# EAGLE design DAUGHTER_AUDIO (EAGLE 7.6.0)
DAUGHTER CARD AUDIO

## Sheet 1 of 3: HDK INTERFACE
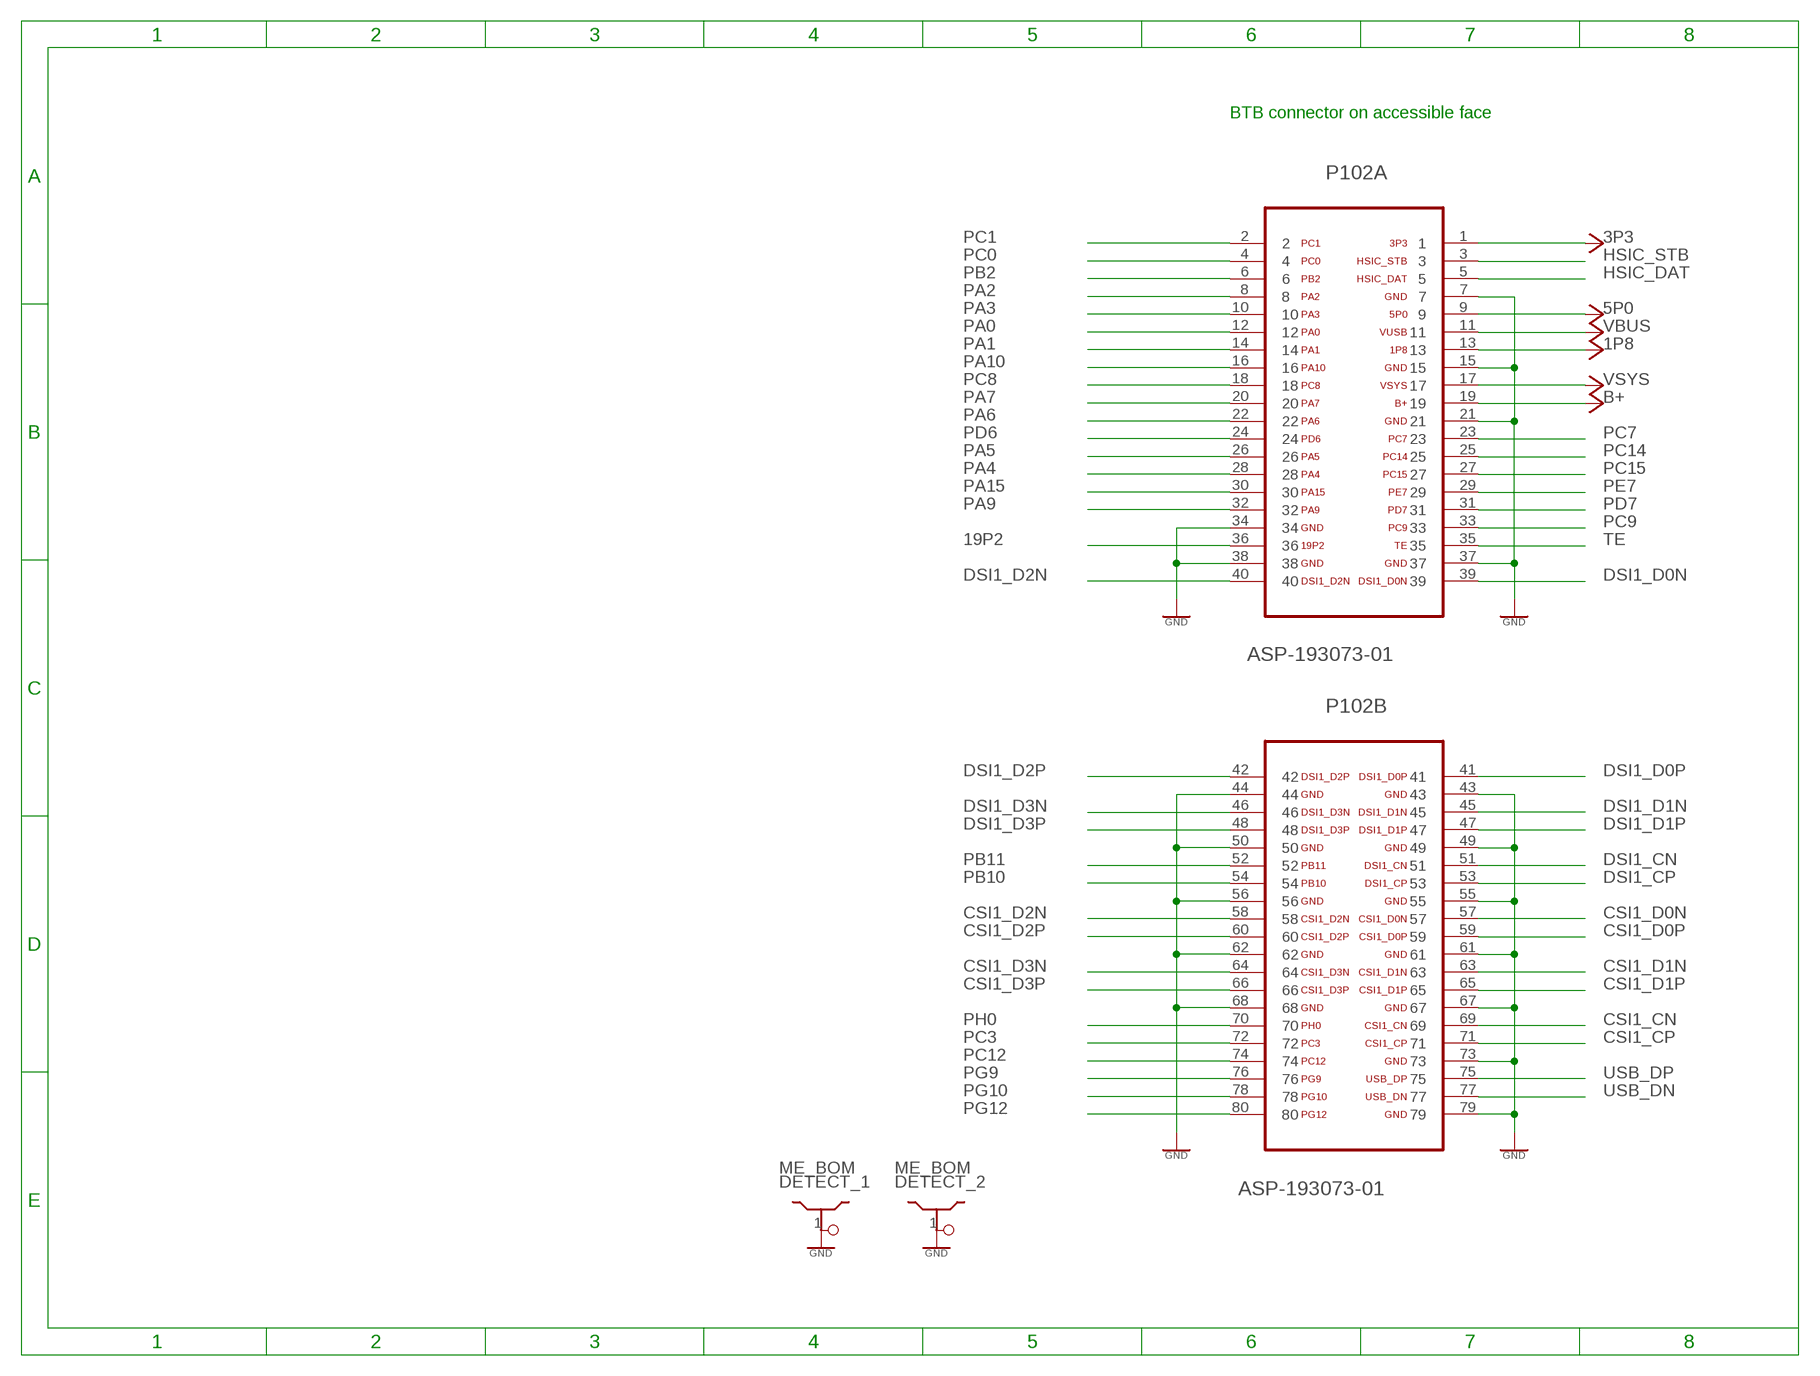
[diagram p0: schematic, sheet 1]

### Parts
DETECT_1  ME_BOM  SHIELDDETECT  [PLUG]
DETECT_2  ME_BOM  SHIELDDETECT  [PLUG]
P102  ASP-193073-01  FTMH-140-02-L-DV-ES-P-TR  [FTMH-140-02-L-DV-ES-P-TR]

### Nets
1P8: P102.13 ; also sheet 2,3
3P3: P102.1 ; also sheet 2
5P0: P102.9
19P2: P102.36
B+: P102.19 ; also sheet 3
CSI1_CN: P102.69
CSI1_CP: P102.71
CSI1_D0N: P102.57
CSI1_D0P: P102.59
CSI1_D1N: P102.63
CSI1_D1P: P102.65
CSI1_D2N: P102.58
CSI1_D2P: P102.60
CSI1_D3N: P102.64
CSI1_D3P: P102.66
DSI1_CN: P102.51
DSI1_CP: P102.53
DSI1_D0N: P102.39
DSI1_D0P: P102.41
DSI1_D1N: P102.45
DSI1_D1P: P102.47
DSI1_D2N: P102.40
DSI1_D2P: P102.42
DSI1_D3N: P102.46
DSI1_D3P: P102.48
GND: DETECT_1.1 DETECT_2.1 P102.7 P102.15 P102.21 P102.34 P102.37 P102.38 P102.43 P102.44 P102.49 P102.50 P102.55 P102.56 P102.61 P102.62 P102.67 P102.68 P102.73 P102.79 ; also sheet 2,3
HSIC_DAT: P102.5
HSIC_STB: P102.3
PA0: P102.12
PA1: P102.14
PA2: P102.8
PA3: P102.10
PA4: P102.28
PA5: P102.26
PA6: P102.22
PA7: P102.20
PA9: P102.32
PA10: P102.16
PA15: P102.30
PB2: P102.6
PB10: P102.54 ; also sheet 2
PB11: P102.52 ; also sheet 2
PC0: P102.4 ; also sheet 3
PC1: P102.2 ; also sheet 3
PC3: P102.72
PC7: P102.23 ; also sheet 3
PC8: P102.18
PC9: P102.33
PC12: P102.74
PC14: P102.25 ; also sheet 3
PC15: P102.27 ; also sheet 3
PD6: P102.24
PD7: P102.31 ; also sheet 3
PE7: P102.29 ; also sheet 3
PG9: P102.76 ; also sheet 2
PG10: P102.78 ; also sheet 3
PG12: P102.80
PH0: P102.70 ; also sheet 3
TE: P102.35
USB_DN: P102.77
USB_DP: P102.75
VBUS: P102.11
VSYS: P102.17

### Notes on the sheet
- BTB connector on accessible face

## Sheet 2 of 3: Identification
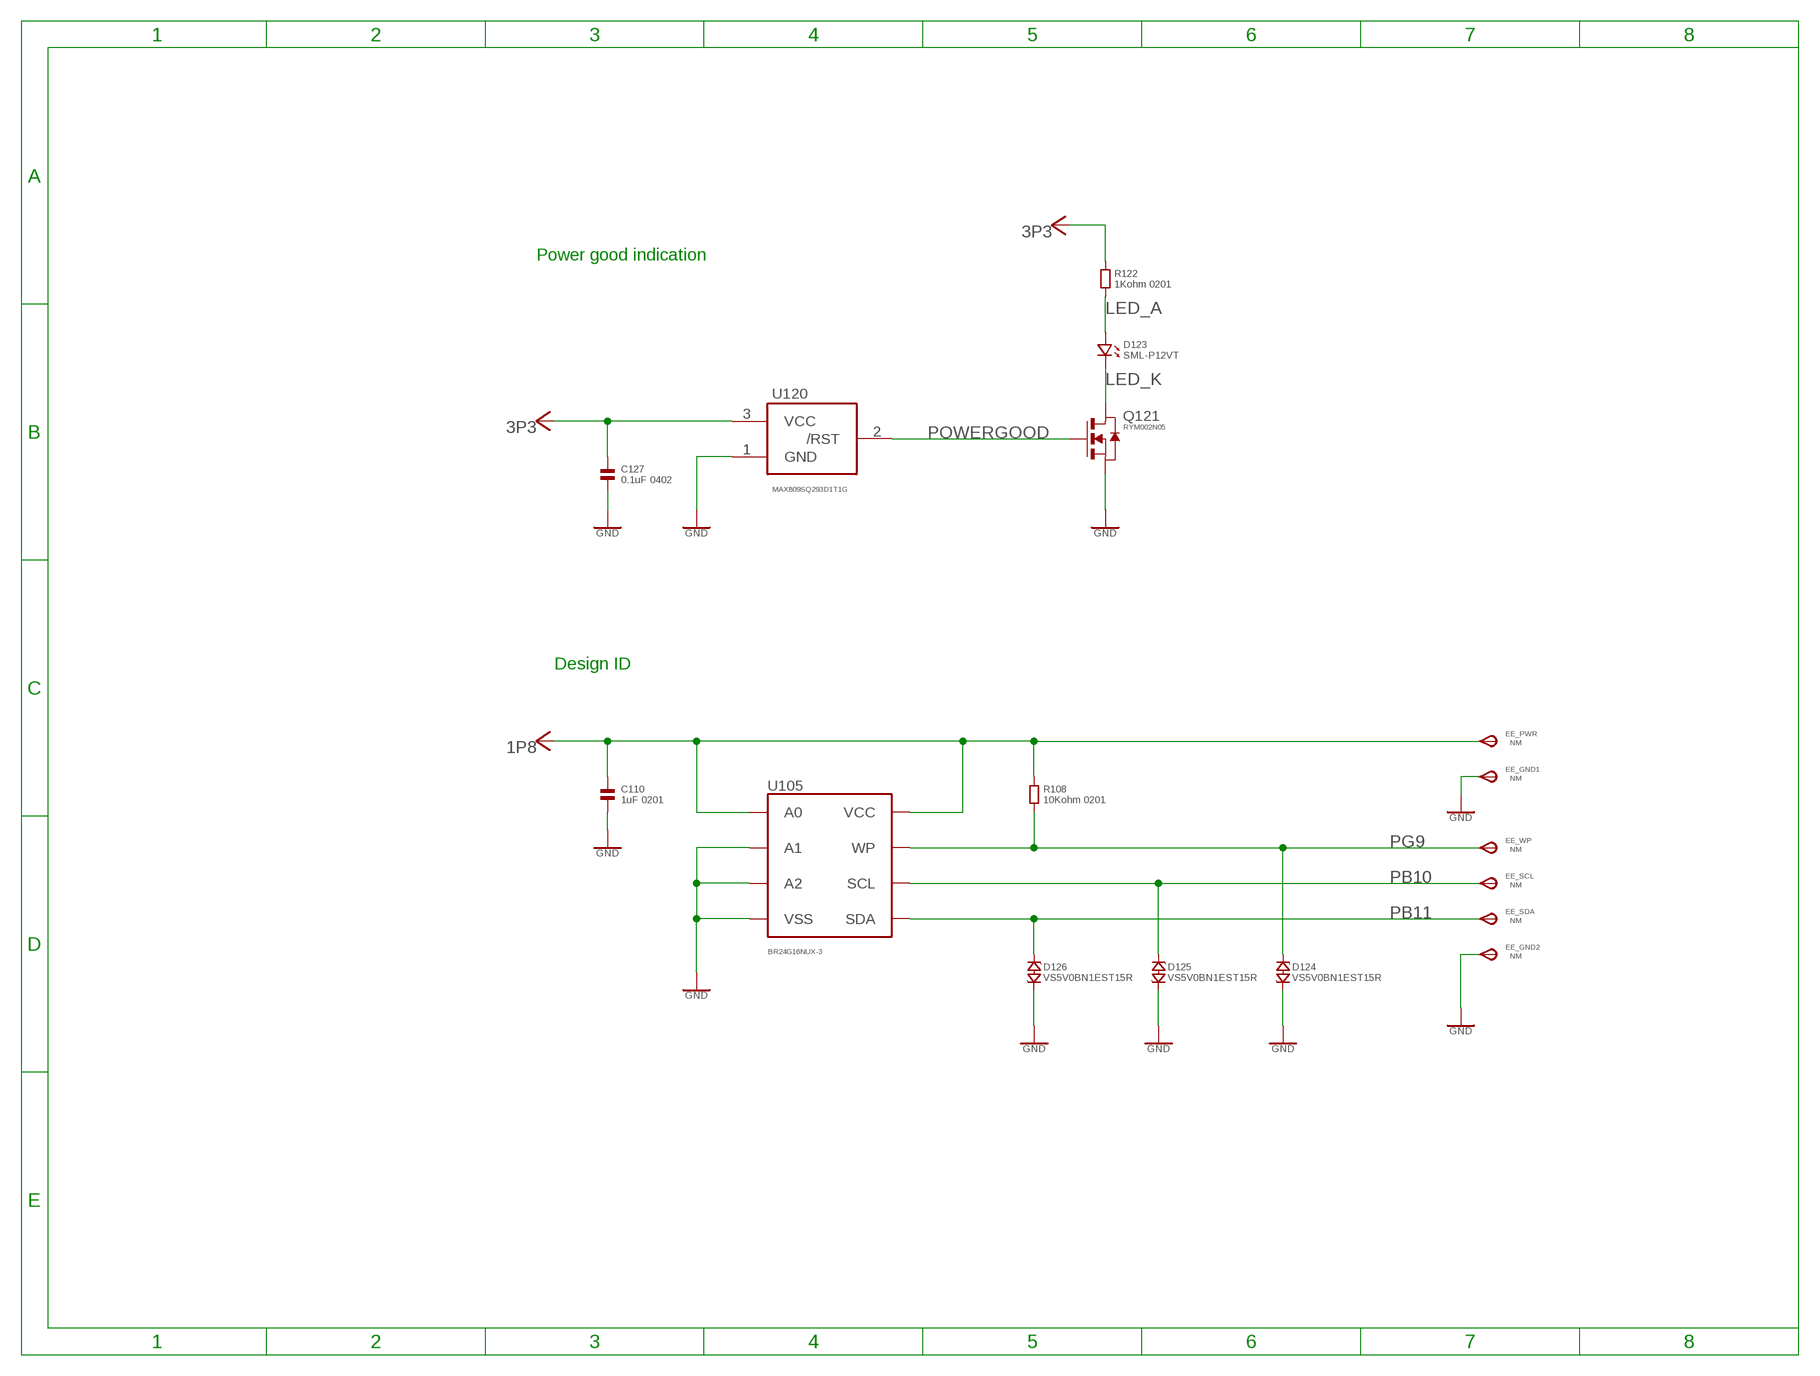
[diagram p1: schematic, sheet 2]

### Parts
C110  1uF 0201  CAPACITOR.0201  [0201]
C127  0.1uF 0402  CAPACITOR.0402  [0402]
D123  SML-P12VT  LED.0503  [0503.LED]
D124  VS5V0BN1EST15R  ESD_VARISTOR.0201  [CHIP_0201]
D125  VS5V0BN1EST15R  ESD_VARISTOR.0201  [CHIP_0201]
D126  VS5V0BN1EST15R  ESD_VARISTOR.0201  [CHIP_0201]
EE_GND1  NM  TPSTP11R  [TP11R]
EE_GND2  NM  TPSTP11R  [TP11R]
EE_PWR  NM  TPSTP11R  [TP11R]
EE_SCL  NM  TPSTP11R  [TP11R]
EE_SDA  NM  TPSTP11R  [TP11R]
EE_WP  NM  TPSTP11R  [TP11R]
Q121  RYM002N05  FET-NRYM002N05  [VMT3]
R108  10Kohm 0201  RESISTOR.0201  [0201]
R122  1Kohm 0201  RESISTOR.0201  [0201]
U105  BR24G16NUX-3  EEPROMDFN8  [DFN-8]
U120  MAX809SQ293D1T1G  MAX809  [SC70-3L]

### Nets
1P8: C110.1 EE_PWR.TP(PP) R108.1 U105.P$1(A0) U105.P$8(VCC) ; also sheet 1,3
3P3: C127.1 R122.1 U120.3(VCC) ; also sheet 1
GND: C110.2 C127.2 D124.P$2 D125.P$2 D126.P$2 EE_GND1.TP(PP) EE_GND2.TP(PP) Q121.2(S) U105.P$2(A1) U105.P$3(A2) U105.P$4(VSS) U105.P$9(VSS) U120.1(GND) ; also sheet 1,3
LED_A: D123.P$1 R122.2
LED_K: D123.P$2 Q121.3(D)
PB10: D125.P$1 EE_SCL.TP(PP) U105.P$6(SCL) ; also sheet 1
PB11: D126.P$1 EE_SDA.TP(PP) U105.P$5(SDA) ; also sheet 1
PG9: D124.P$1 EE_WP.TP(PP) R108.2 U105.P$7(WP) ; also sheet 1
POWERGOOD: Q121.1(G) U120.2(/RST)

### Notes on the sheet
- Power good indication
- Design ID

## Sheet 3 of 3: LOUD SPEAKER
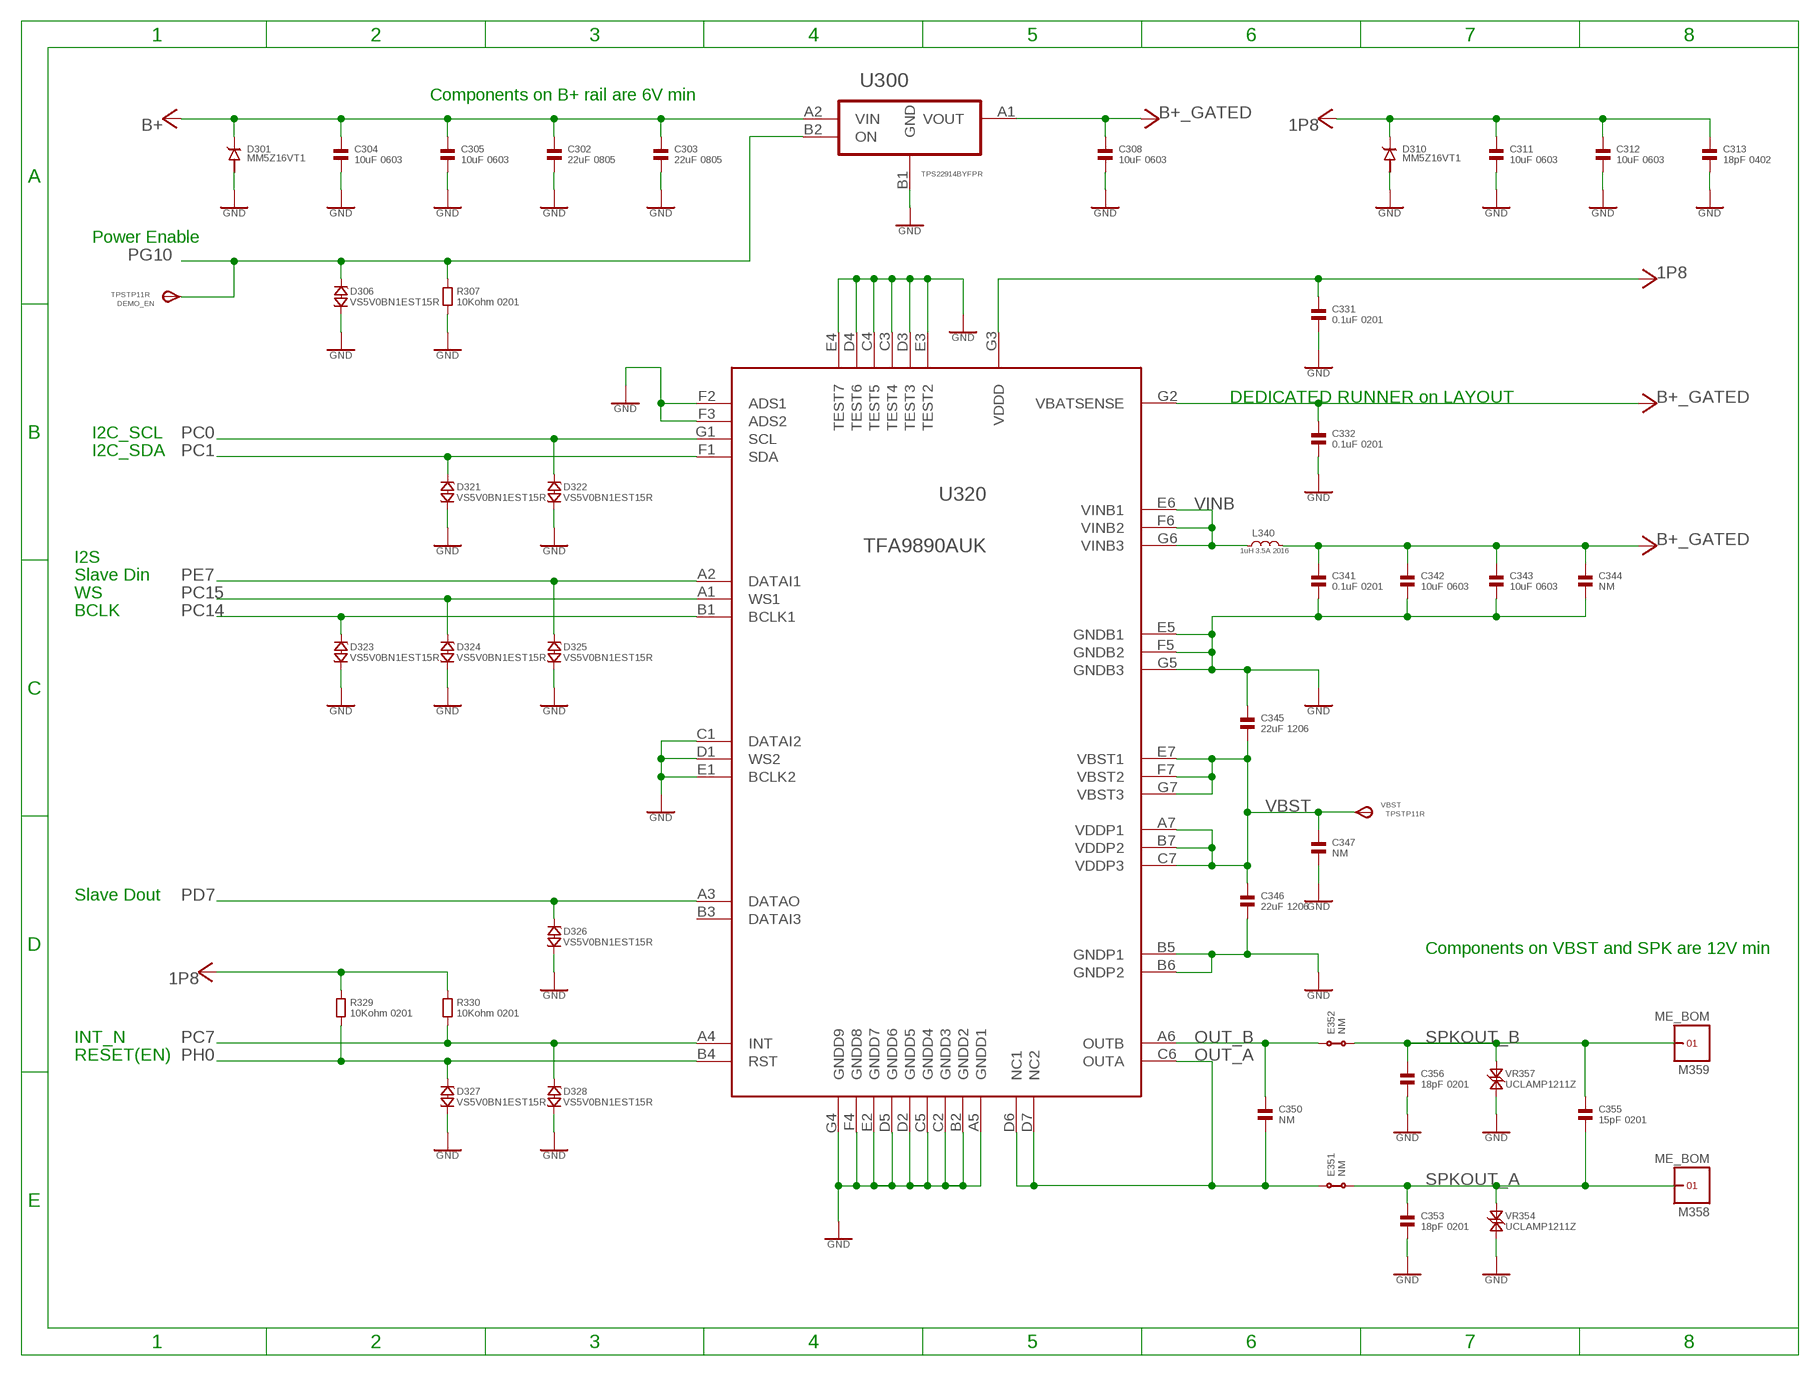
[diagram p2: schematic, sheet 3]

### Parts
C302  22uF 0805  CAPACITOR.0805  [0805]
C303  22uF 0805  CAPACITOR.0805  [0805]
C304  10uF 0603  CAPACITOR.0603  [0603]
C305  10uF 0603  CAPACITOR.0603  [0603]
C308  10uF 0603  CAPACITOR.0603  [0603]
C311  10uF 0603  CAPACITOR.0603  [0603]
C312  10uF 0603  CAPACITOR.0603  [0603]
C313  18pF 0402  CAPACITOR.0402  [0402]
C331  0.1uF 0201  CAPACITOR.0201  [0201]
C332  0.1uF 0201  CAPACITOR.0201  [0201]
C341  0.1uF 0201  CAPACITOR.0201  [0201]
C342  10uF 0603  CAPACITOR.0603  [0603]
C343  10uF 0603  CAPACITOR.0603  [0603]
C344  NM  CAPACITOR.0402  [0402]
C345  22uF 1206  CAPACITOR.1206  [1206]
C346  22uF 1206  CAPACITOR.1206  [1206]
C347  NM  CAPACITOR.0402  [0402]
C350  NM  CAPACITOR.0201  [0201]
C353  18pF 0201  CAPACITOR.0201  [0201]
C355  15pF 0201  CAPACITOR.0201  [0201]
C356  18pF 0201  CAPACITOR.0201  [0201]
D301  MM5Z16VT1  DIODE.SOD523  [SOD523]
D306  VS5V0BN1EST15R  ESD_VARISTOR.0201  [CHIP_0201]
D310  MM5Z16VT1  DIODE.SOD523  [SOD523]
D321  VS5V0BN1EST15R  ESD_VARISTOR.0201  [CHIP_0201]
D322  VS5V0BN1EST15R  ESD_VARISTOR.0201  [CHIP_0201]
D323  VS5V0BN1EST15R  ESD_VARISTOR.0201  [CHIP_0201]
D324  VS5V0BN1EST15R  ESD_VARISTOR.0201  [CHIP_0201]
D325  VS5V0BN1EST15R  ESD_VARISTOR.0201  [CHIP_0201]
D326  VS5V0BN1EST15R  ESD_VARISTOR.0201  [CHIP_0201]
D327  VS5V0BN1EST15R  ESD_VARISTOR.0201  [CHIP_0201]
D328  VS5V0BN1EST15R  ESD_VARISTOR.0201  [CHIP_0201]
DEMO_EN  TPSTP11R  [TP11R]
E351  NM  SHORT_BAR.0603  [0603_SHORT]
E352  NM  SHORT_BAR.0603  [0603_SHORT]
L340  1uH 3.5A 2016  POWER-INDUCTOR.2016  [2016]
M358  ME_BOM  PUCK.PUCK  [PUCK]
M359  ME_BOM  PUCK.PUCK  [PUCK]
R307  10Kohm 0201  RESISTOR.0201  [0201]
R329  10Kohm 0201  RESISTOR.0201  [0201]
R330  10Kohm 0201  RESISTOR.0201  [0201]
U300  TPS22914BYFPR  [BGA0_75SQ_PS0_4_P4]
U320  TFA9890AUK  [BGA7X7]
VBST  TPSTP11R  [TP11R]
VR354  UCLAMP1211Z  ESD_TVS.0201  [CHIP_0201]
VR357  UCLAMP1211Z  ESD_TVS.0201  [CHIP_0201]

### Nets
1P8: C311.1 C312.1 C313.1 C331.1 D310.1 R329.1 R330.1 U320.G3(VDDD) ; also sheet 1,2
B+: C302.1 C303.1 C304.1 C305.1 D301.1 U300.A2(VIN) ; also sheet 1
B+_GATED: C308.1 C332.1 C341.1 C342.1 C343.1 C344.1 L340.2 U300.A1(VOUT) U320.G2(VBATSENSE)
GND: C302.2 C303.2 C304.2 C305.2 C308.2 C311.2 C312.2 C313.2 C331.2 C332.2 C341.2 C342.2 C343.2 C344.2 C345.1 C346.2 C347.2 C353.2 C356.2 D301.2 D306.P$2 D310.2 D321.P$2 D322.P$2 D323.P$2 D324.P$2 D325.P$2 D326.P$2 D327.P$2 D328.P$2 R307.2 U300.B1(GND) U320.A5(GNDD1) U320.B2(GNDD2) U320.B5(GNDP1) U320.B6(GNDP2) U320.C1(DATAI2) U320.C2(GNDD3) U320.C3(TEST4) U320.C4(TEST5) U320.C5(GNDD4) U320.D1(WS2) U320.D2(GNDD5) U320.D3(TEST3) U320.D4(TEST6) U320.D5(GNDD6) U320.E1(BCLK2) U320.E2(GNDD7) U320.E3(TEST2) U320.E4(TEST7) U320.E5(GNDB1) U320.F2(ADS1) U320.F3(ADS2) U320.F4(GNDD8) U320.F5(GNDB2) U320.G4(GNDD9) U320.G5(GNDB3) VR354.P$2 VR357.P$2 ; also sheet 1,2
OUT_A: C350.2 E351.1 U320.C6(OUTA) U320.D6(NC1) U320.D7(NC2)
OUT_B: C350.1 E352.1 U320.A6(OUTB)
PC0: D322.P$1 U320.G1(SCL) ; also sheet 1
PC1: D321.P$1 U320.F1(SDA) ; also sheet 1
PC7: D328.P$1 R330.2 U320.A4(INT) ; also sheet 1
PC14: D323.P$1 U320.B1(BCLK1) ; also sheet 1
PC15: D324.P$1 U320.A1(WS1) ; also sheet 1
PD7: D326.P$1 U320.A3(DATAO) ; also sheet 1
PE7: D325.P$1 U320.A2(DATAI1) ; also sheet 1
PG10: D306.P$1 DEMO_EN.TP(PP) R307.1 U300.B2(ON) ; also sheet 1
PH0: D327.P$1 R329.2 U320.B4(RST) ; also sheet 1
SPKOUT_A: C353.1 C355.2 E351.2 M358.1 VR354.P$1
SPKOUT_B: C355.1 C356.1 E352.2 M359.1 VR357.P$1
VBST: C345.2 C346.1 C347.1 U320.A7(VDDP1) U320.B7(VDDP2) U320.C7(VDDP3) U320.E7(VBST1) U320.F7(VBST2) U320.G7(VBST3) VBST.TP(PP)
VINB: L340.1 U320.E6(VINB1) U320.F6(VINB2) U320.G6(VINB3)
Unconnected: U320.B3(DATAI3)

### Notes on the sheet
- Components on B+ rail are 6V min
- Power Enable
- DEDICATED RUNNER on LAYOUT
- I2C_SCL
- I2C_SDA
- I2S
- Slave Din
- WS
- BCLK
- Slave Dout
- Components on VBST and SPK are 12V min
- INT_N
- RESET(EN)

## Library data of the parts
C110 C127 C302-C305 C308 C311-C313 C331 C332 C341-C347 C350 C353 C355 C356 = MOTO_LIB:CAPACITOR: Ceramic Capacitor, Generic
D123 = MOTO_LIB:LED: LED GENERIC, single, 2 pin; MPN: SML-P12VT; SUPPLIER: ROHM
D124-D126 D306 D321-D328 = MOTO_LIB:ESD_VARISTOR: GENERIC varistor,single, 2 pin; MPN: VS5V0BN1EST15R; SUPPLIER: ROHM
D301 D310 = MOTO_LIB:DIODE: DIODE GENERIC, single, 2 pin; MPN: MM5Z16VT1; SUPPLIER: ON_SEMI
DEMO_EN EE_GND1 EE_GND2 EE_PWR EE_SCL EE_SDA EE_WP VBST = MOTO_LIB:TPS: TEST Point, 1mm diameter, gold
DETECT_1 DETECT_2 = MOTO_LIB:SHIELD: Shield, Custom; MPN: refer to ME BOM; SUPPLIER: ref to ME BOM
E351 E352 = MOTO_LIB:SHORT_BAR: SHORT BAR - layout feature
L340 = MOTO_LIB:POWER-INDUCTOR: Inductor, Power
M358 M359 = MOTO_LIB:PUCK: test pad; MPN: refer to ME BOM; SUPPLIER: refer to ME BOM
P102 = MOTO_LIB:FTMH-140-02-L-DV-ES-P-TR: MICRO SOCKET, 1.0MM, SMD, 2X40WAY, MALE; MPN: ASP-193073-01; SUPPLIER: SAMTEC
Q121 = MOTO_LIB:FET-N: Generic NMOS FET; MPN: RYM002N05; SUPPLIER: ROHM
R108 R122 R307 R329 R330 = MOTO_LIB:RESISTOR: Resistor - Generic
U105 = MOTO_LIB:EEPROM: I2C EE PROM, 8 pin; MPN: BR24G16NUX-3; SUPPLIER: ROHM
U120 = MOTO_LIB:MAX809: 3-Pin Microprocessor Reset Circuit; MPN: MAX809SQ293D1T1; SUPPLIER: ON-SEMI
U300 = MOTO_LIB:TPS22914BYFPR: 5V load switch; MPN: TPS22914BYFPR; SUPPLIER: TI
U320 = MOTO_LIB:TFA9890AUK: Audio Power amplifier; MPN: TFA9890AUK; SUPPLIER: NXP
VR354 VR357 = MOTO_LIB:ESD_TVS: GENERIC TVS,single, 2 pin; MPN: UCLAMP1211Z; SUPPLIER: SEMTECH

## Board
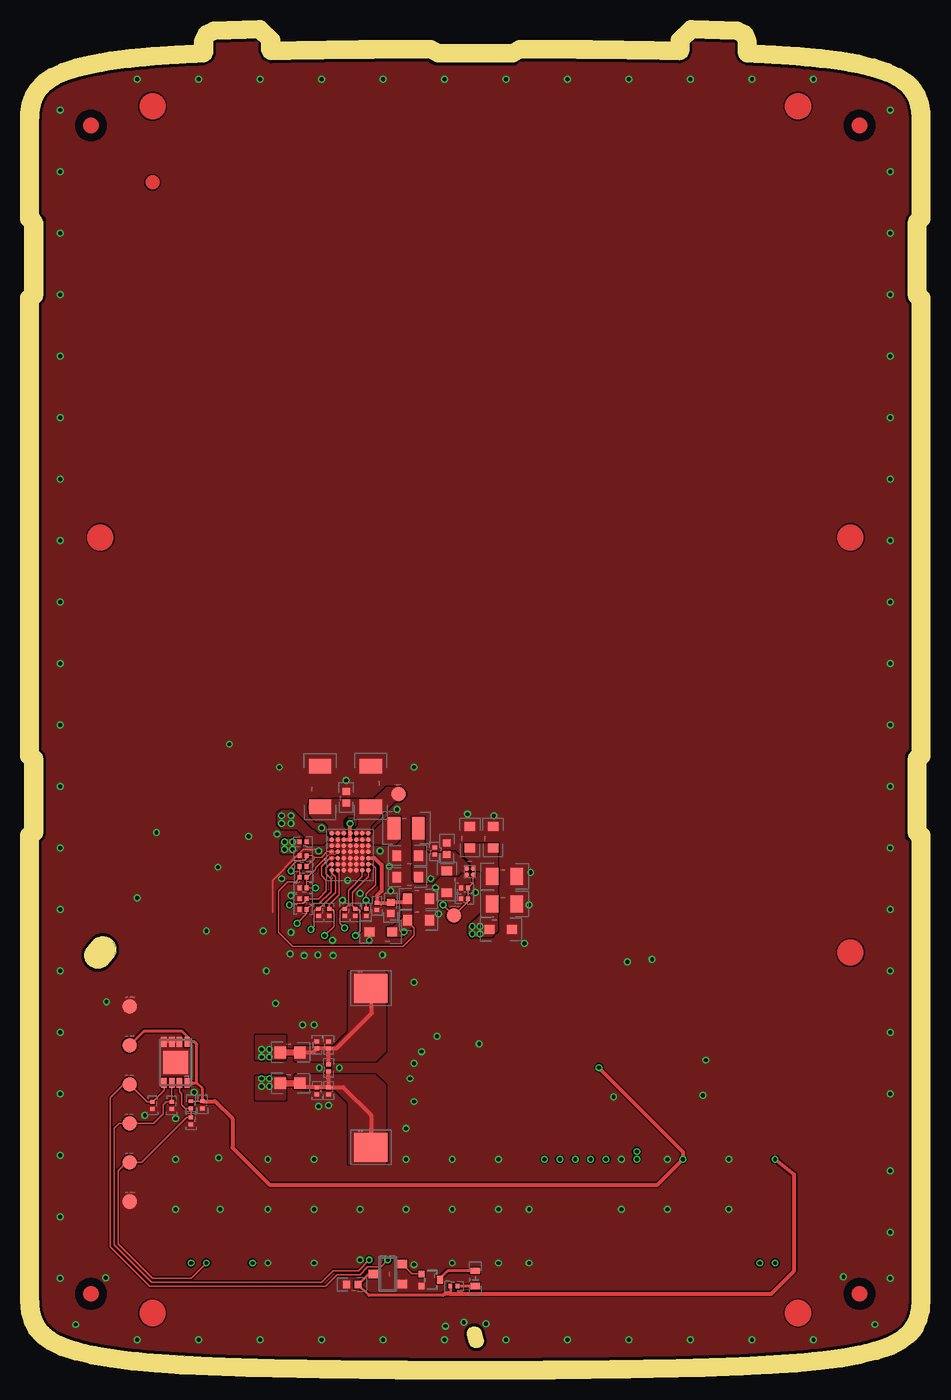
[diagram p3: board, top side]
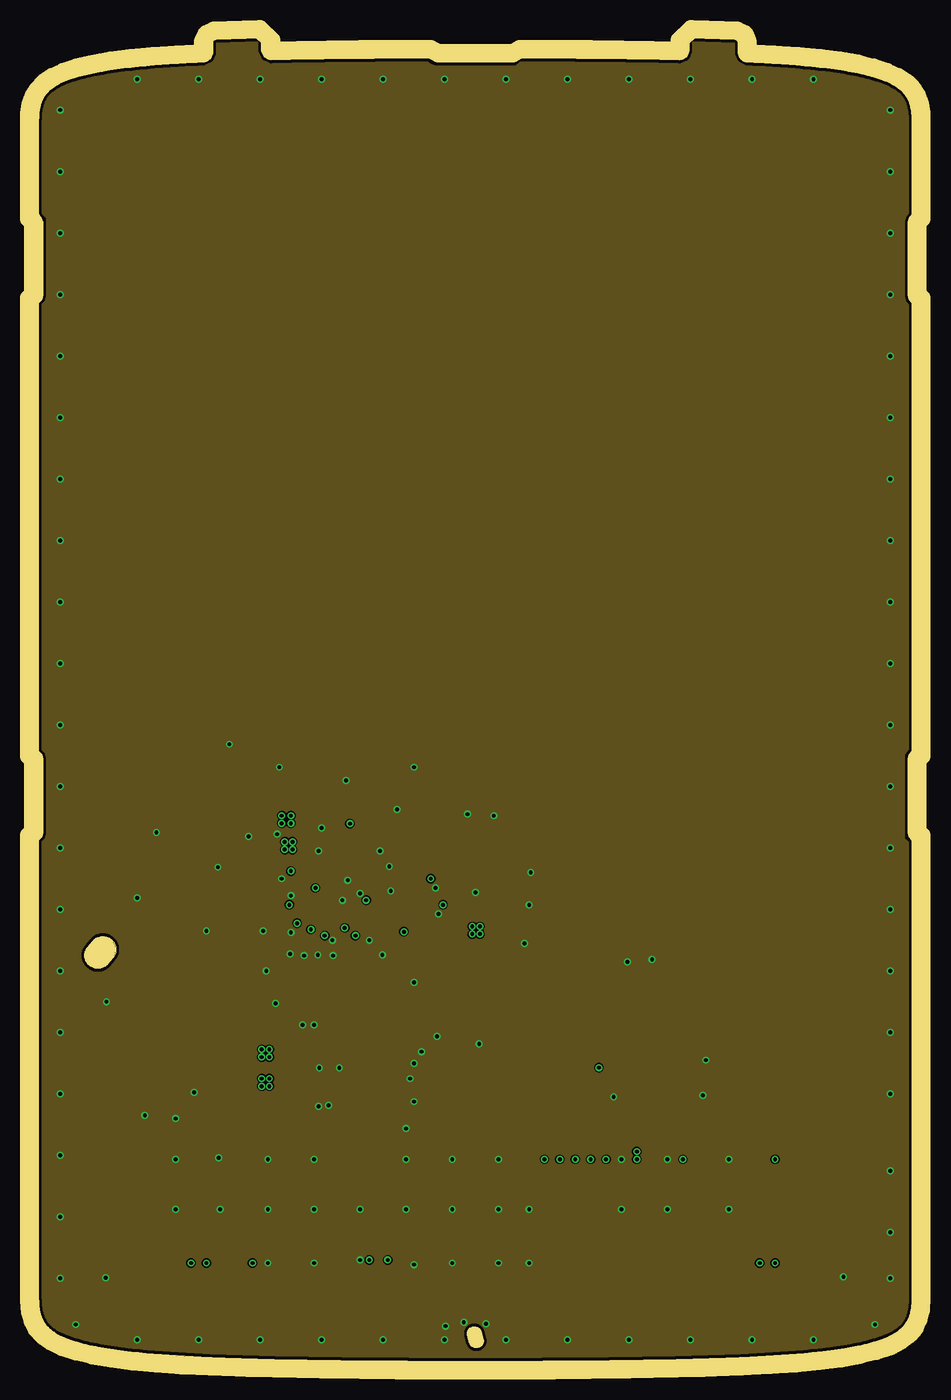
[diagram p4: board, inner layer Route2]
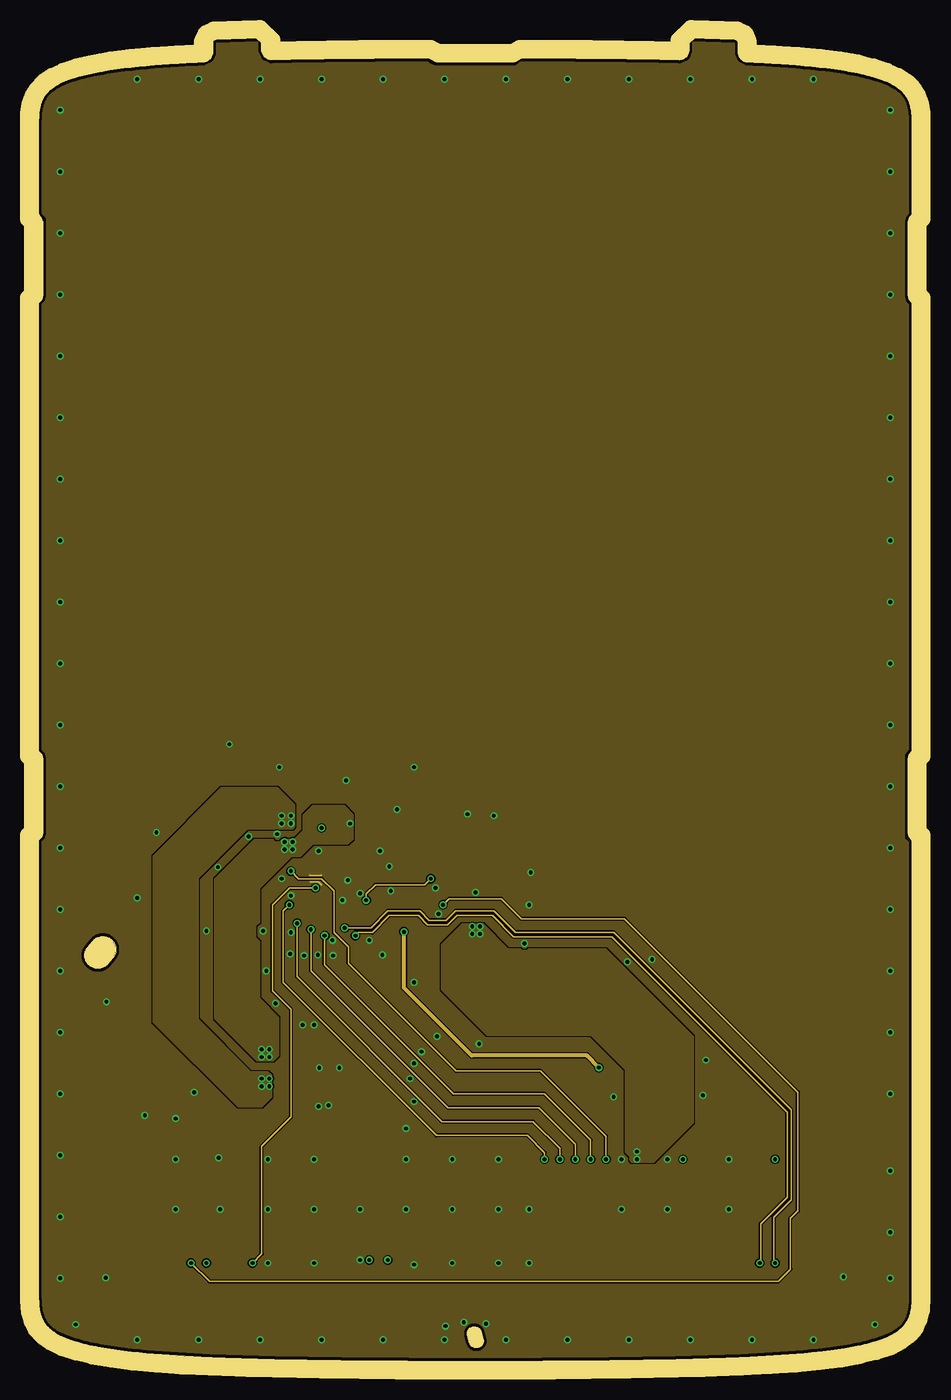
[diagram p5: board, inner layer Route15]
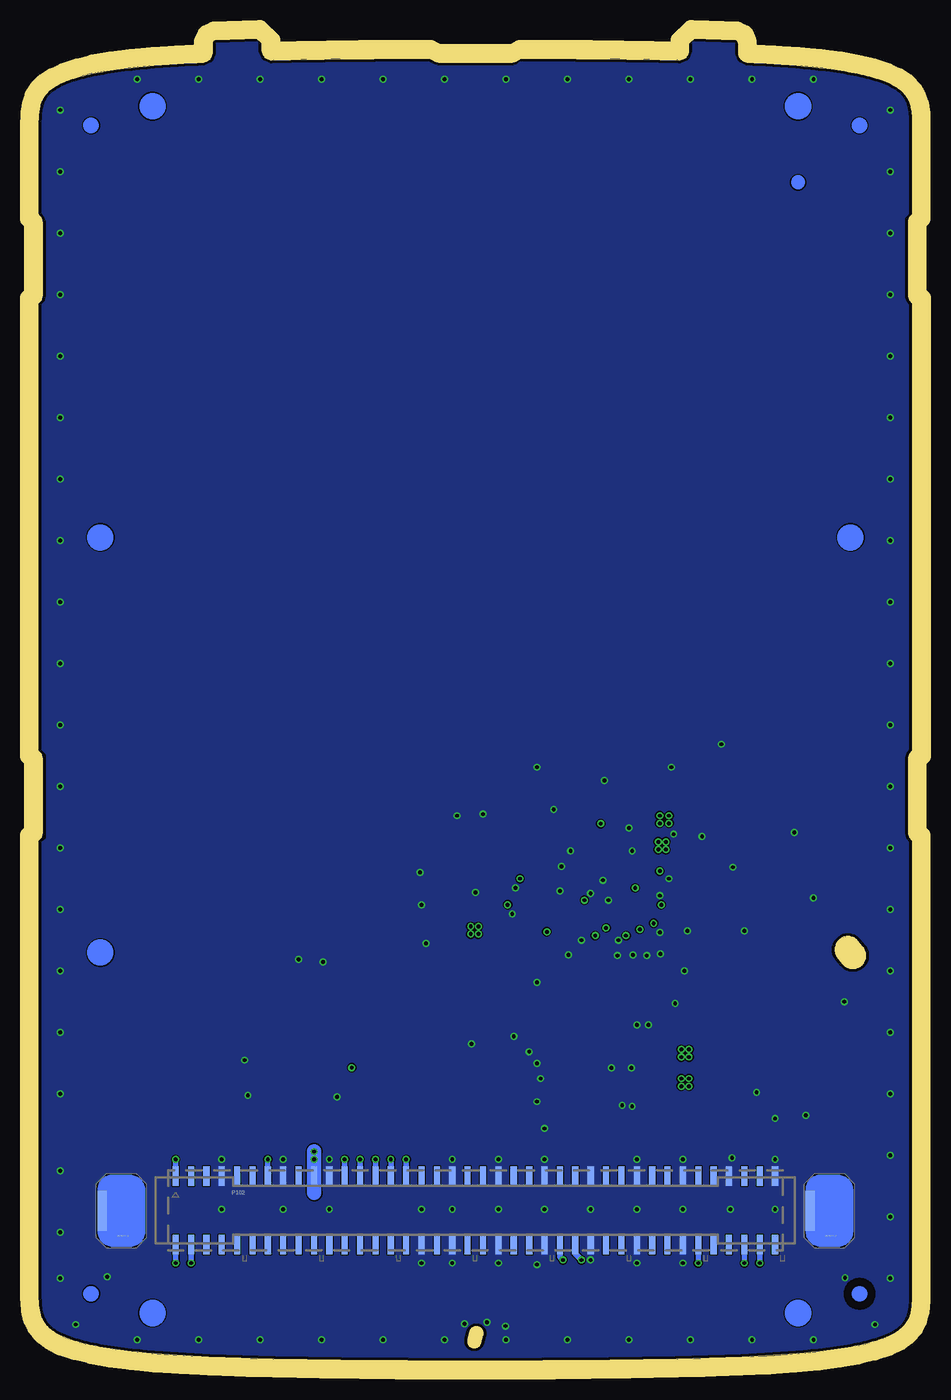
[diagram p6: board, bottom side, seen from below]

Size 56.85 x 86.03 mm. Coordinates in mm from the lower left corner, seen from the top.
Outline: 357 segments
Copper layers (1*2*15*16): Top 0.02mm / dielectric 0.045mm / Route2 0.016mm / dielectric 0.711mm / Route15 0.016mm / dielectric 0.045mm / Bottom 0.02mm
Design rules "constraint": minimum track width 0.08mm, minimum drill 0.25mm, track to track 0.08mm, track to pad 0.08mm, pad to pad 0.08mm, via to via 0.08mm, smd to smd 0.08mm, copper to edge 0.2mm, drill to drill 0.2mm, minimum pad ring 0.1mm, minimum via ring 0.1mm, stop-mask expansion 0mil, vias tented up to drill 0.25mm, thermal gap 0mil
tRestrict: area 3.4,3.4 to 4.4,5.4; area 2.4,3.4 to 3.4,5.4; area 53.4,3.4 to 54.4,5.4; area 52.4,3.4 to 53.4,5.4; area 3.4,79.4 to 4.4,81.4; area 2.4,79.4 to 3.4,81.4; area 53.4,79.4 to 54.4,81.4; area 52.4,79.4 to 53.4,81.4
bRestrict: area 2.4,3.4 to 3.4,5.4; area 3.4,3.4 to 4.4,5.4
Milling: 125 lines

### Footprints (pad centres in the part's own frame; a part is rotated, then mirrored left to right if it is on the bottom)
0201 = smd 0.25 x 0.3: 1 -0.23,0; 2 0.23,0
0402 = smd 0.45 x 0.5: 1 -0.37,0; 2 0.37,0
0805 = smd 0.8 x 1.1: 1 -0.8,0; 2 0.8,0
0603 = smd 0.58 x 0.68: 1 -0.71,0; 2 0.71,0
1206 = smd 0.96 x 1.46: 1 -1.32,0; 2 1.32,0
0503.LED = smd 0.4 x 0.6: P$1 -0.495,0; P$2 0.495,0
CHIP_0201 = smd 0.25 x 0.3: P$1 -0.23,0; P$2 0.23,0
SOD523 = smd 0.64 x 0.59: 1 -0.73,0; 2 0.73,0
TP11R = smd 0.95 x 0.95: TP 0,0
PLUG = smd 0.6 x 2.6: 1 -1.25,0
0603_SHORT = smd 0.76 x 0.76: 1 -0.63,0; 2 0.63,0
2016 = smd 0.82 x 1.46: 1 -0.79,0; 2 0.79,0
PUCK = smd 2.2 x 1.9: 1 0,0
FTMH-140-02-L-DV-ES-P-TR = smd 0.4 x 1.263: 1 -19.5,2.223; 2 -19.5,-2.223; 3 -18.5,2.223; 4 -18.5,-2.223; 5 -17.5,2.223; 6 -17.5,-2.223; 7 -16.5,2.223; 8 -16.5,-2.223; 9 -15.5,2.223; 10 -15.5,-2.223; 11 -14.5,2.223; 12 -14.5,-2.223; 13 -13.5,2.223; 14 -13.5,-2.223; 15 -12.5,2.223; 16 -12.5,-2.223; 17 -11.5,2.223; 18 -11.5,-2.223; 19 -10.5,2.223; 20 -10.5,-2.223; 21 -9.5,2.223; 22 -9.5,-2.223; 23 -8.5,2.223; 24 -8.5,-2.223; 25 -7.5,2.223; 26 -7.5,-2.223; 27 -6.5,2.223; 28 -6.5,-2.223; 29 -5.5,2.223; 30 -5.5,-2.223; 31 -4.5,2.223; 32 -4.5,-2.223; 33 -3.5,2.223; 34 -3.5,-2.223; 35 -2.5,2.223; 36 -2.5,-2.223; 37 -1.5,2.223; 38 -1.5,-2.223; 39 -0.5,2.223; 40 -0.5,-2.223; 41 0.5,2.223; 42 0.5,-2.223; 43 1.5,2.223; 44 1.5,-2.223; 45 2.5,2.223; 46 2.5,-2.223; 47 3.5,2.223; 48 3.5,-2.223; 49 4.5,2.223; 50 4.5,-2.223; 51 5.5,2.223; 52 5.5,-2.223; 53 6.5,2.223; 54 6.5,-2.223; 55 7.5,2.223; 56 7.5,-2.223; 57 8.5,2.223; 58 8.5,-2.223; 59 9.5,2.223; 60 9.5,-2.223; 61 10.5,2.223; 62 10.5,-2.223; 63 11.5,2.223; 64 11.5,-2.223; 65 12.5,2.223; 66 12.5,-2.223; 67 13.5,2.223; 68 13.5,-2.223; 69 14.5,2.223; 70 14.5,-2.223; 71 15.5,2.223; 72 15.5,-2.223; 73 16.5,2.223; 74 16.5,-2.223; 75 17.5,2.223; 76 17.5,-2.223; 77 18.5,2.223; 78 18.5,-2.223; 79 19.5,2.223; 80 19.5,-2.223
VMT3 = smd 0.42 x 0.4: 1 -0.4,-0.6; 2 0.4,-0.6 | smd 0.52 x 0.4: 3 0,0.6
DFN-8 = smd 0.35 x 0.65: P$1 -0.75,-1.325; P$2 -0.25,-1.325; P$3 0.25,-1.325; P$4 0.75,-1.325; P$5 0.75,1.325; P$6 0.25,1.325; P$7 -0.25,1.325; P$8 -0.75,1.325 | smd 1.6 x 1.5: P$9 0,0
SC70-3L = smd 0.55 x 0.63: 1 -0.65,-0.94; 3 0,0.94 | smd 0.555 x 0.63: 2 0.65,-0.94
BGA0_75SQ_PS0_4_P4 = smd 0.32 x 0.32: A1 -0.2,0.2; A2 0.2,0.2; B1 -0.2,-0.2; B2 0.2,-0.2
BGA7X7 = smd 0.32 x 0.32: A1 -1,1.2; A2 -0.6,1.2; A5 0.6,1.2; A6 1,1.2; A7 1.4,1.2; B1 -1,0.8; B2 -0.6,0.8; B3 -0.2,0.8; B4 0.2,0.8; B5 0.6,0.8; B6 1,0.8; B7 1.4,0.8; C1 -1,0.4; C2 -0.6,0.4; C3 -0.2,0.4; C4 0.2,0.4; C5 0.6,0.4; C6 1,0.4; C7 1.4,0.4; D1 -1,0; D2 -0.6,0; D3 -0.2,0; D4 0.2,0; D5 0.6,0; D6 1,0; D7 1.4,0; E1 -1,-0.4; E2 -0.6,-0.4; E3 -0.2,-0.4; E4 0.2,-0.4; E5 0.6,-0.4; E6 1,-0.4; E7 1.4,-0.4; F1 -1,-0.8; F2 -0.6,-0.8; F3 -0.2,-0.8; F4 0.2,-0.8; F5 0.6,-0.8; F6 1,-0.8; F7 1.4,-0.8; G1 -1,-1.2; G2 -0.6,-1.2; G3 -0.2,-1.2; G4 0.2,-1.2; G5 0.6,-1.2; G6 1,-1.2; G7 1.4,-1.2 | smd 0.22 x 0.22: A3 -0.2,1.2; A4 0.2,1.2

### Placement (x,y rotation side)
C110  10.67,16.67 270 top
C127  20.42,4.97 180 top
C302  30.32,31.52 0 top
C303  30.32,29.72 0 top
C304  28.07,34.07 90 top
C305  29.57,34.07 90 top
C308  26.57,31.17 270 top
C311  24.72,28.67 0 top
C312  24.72,30.07 0 top
C313  22.92,29.47 270 top
C331  22.02,29.57 270 top
C332  21.32,29.17 270 top
C341  25.77,33.17 90 top
C342  24.02,32.87 180 top
C343  24.02,31.47 180 top
C344  26.57,33.32 90 top
C345  21.62,37.37 270 top
C346  18.32,37.37 90 top
C347  20.02,36.67 90 top
C350  17.22,33.77 180 top
C353  18.87,20.57 90 top
C355  18.87,19.07 90 top
C356  18.87,17.57 270 top
D123  28.42,5.37 90 top
D124  9.92,15.62 270 top
D125  8.67,16.62 270 top
D126  7.42,16.62 270 top
D301  30.07,28.07 0 top
D306  27.72,30.77 180 top
D310  22.27,27.92 180 top
D321  19.92,29.17 270 top
D322  20.62,29.17 270 top
D323  18.92,29.17 270 top
D324  18.22,29.17 270 top
D325  17.22,29.37 180 top
D326  17.22,30.07 180 top
D327  17.22,30.77 180 top
D328  17.22,32.87 180 top
DEMO_EN  27.02,28.97 0 top
DETECT_1  51.45,9.77 0 bottom
DETECT_2  5.39,9.77 0 bottom
E351  16.37,20.07 0 top
E352  16.37,18.07 0 top
EE_GND1  5.92,10.37 0 top
EE_GND2  5.92,23.07 0 top
EE_PWR  5.92,20.53 0 top
EE_SCL  5.92,15.45 0 top
EE_SDA  5.92,17.99 0 top
EE_WP  5.92,12.91 0 top
L340  23.92,34.67 0 top
M358  21.62,24.25 0 top
M359  21.62,13.9 0 top
P102  28.42,9.8 0 bottom
Q121  25.52,5.27 270 top
R108  9.92,16.67 270 top
R122  27.02,4.87 0 top
R307  27.72,30.07 180 top
R329  17.22,31.47 0 top
R330  17.22,32.17 0 top
U105  8.92,19.42 180 top
U120  22.72,5.67 90 top
U300  28.07,31.82 0 top
U320  20.27,32.92 90 top
VBST  23.42,36.87 0 top
VR354  18.12,20.57 90 top
VR357  18.12,17.57 270 top

### Tracks (layer width: path | path; a pad name or v marks a point on that pad's centre or on a via)
1P8  (via drill 0.25)
  Top 0.1: R108.1 C110.1 | R330.1 R329.1 16.99,31.44 16.72,31.17 16.22,31.17 15.62,30.57 15.62,27.87 16.52,26.97 23.72,26.97 24.42,27.67 24.42,28.17 24.22,28.37 24.22,28.46 C311.1 | U320.G3
  Top 0.2: EE_PWR.TP 6.86,21.47 9.32,21.47 9.67,21.12 U105.P$1 10.15,20.75 10.3,20.6 10.3,18.1 | U105.P$8 10.3,18.1 | 10.3,18.1 10.67,17.72 C110.1
  Top 0.25: U320.G3 21.86,32.73 22.32,32.27 22.32,30.57 22.02,30.27 C331.1 22.88,29.8 C313.1 23.78,29.84 C312.1 | C110.1 11.49,16.9 12.62,15.77 12.62,13.87 15.02,11.47 40.27,11.47 v41.92,13.12 41.92,13.62 v36.46,19.08
  Route15 0.25: v36.46,19.08 35.67,19.87 28.17,19.87 23.77,24.27 v23.77,27.92
  Bottom 0.35: P102.13 v41.92,13.12
  pour Top: 23.72,30.42 24.17,30.42 24.27,30.32 24.27,28.27 23.62,27.62 22.87,27.62 22.77,27.72 22.77,28.17 22.82,28.22 23.12,28.22 23.67,28.77 23.67,30.37
3P3  (via drill 0.25)
  Top 0.2: U120.3 21.49,5.67 C127.1 21.49,4.27 26.32,4.27 26.42,4.37 | R122.1 26.79,4.37
  Top 0.25: v47.92,13.12 49.17,12.12 49.17,5.87 47.67,4.37 26.79,4.37 26.42,4.37
  Bottom 0.35: P102.1 v47.92,13.12
B+  (via drill 0.25)
  Bottom 0.1: v38.92,13.62 v38.91,13.62 38.91,13.64
  Bottom 0.35: P102.19 v38.92,13.12
  Bottom 0.94: 38.91,10.93 38.91,13.64
  other vias: 28.22,28.27 28.72,28.27 28.72,27.77 28.22,27.77
  pour Route15: 27.57,28.42 28.92,28.42 30.52,26.82 31.32,26.82 31.42,26.72 31.82,26.72 31.92,26.82 36.87,26.82 42.62,21.07 42.62,15.52 40.02,12.92 38.62,12.92 38.47,13.07 38.47,13.32 38.17,13.62 38.17,18.97 35.97,21.17 29.22,21.17 26.22,24.17 26.22,27.07
  pour Top: 27.77,33.62 29.87,33.62 29.87,28.02 29.47,27.62 28.17,27.62 27.97,27.82 27.97,28.22 28.87,29.12 28.87,31.82 28.77,31.92 28.27,31.92 28.17,32.02 28.17,32.42 27.77,32.82
B+_GATED  (via drill 0.25)
  Top 0.1: C332.1 v21.32,29.97 21.32,30.37 21.92,30.97 21.92,32.07 21.66,32.33 21.52,32.33 | U320.G2 21.52,32.33 | U320.G2 21.52,32.32 21.52,32.33
  Route15 0.1: v25.52,31.37 25.12,30.97 21.92,30.97 21.32,30.37 v21.32,29.97
  pour Top: 24.37,35.32 25.07,35.32 25.07,33.22 25.27,33.02 26.27,33.02 26.37,33.12 27.07,33.12 27.97,32.22 27.97,31.97 27.92,31.92 27.72,31.92 27.62,31.82 27.47,31.82 27.27,31.62 26.07,31.62 25.57,31.12 24.57,31.12 24.37,31.32
GND  (via drill 0.25)
  Top 0.1: 15.22,29.17 15.22,31.27 16.82,32.87 D328.P$2 | 16.99,33.04 17.22,33.27 18.12,33.27 v18.22,33.17
  Top 0.2: U105.P$4 U105.P$3 U105.P$2
  Route15 0.1: 17.62,31.62 17.67,31.57 18.37,31.57 18.42,31.62 | 17.67,31.17 18.22,31.17 18.42,30.97
  other vias: 14.42,1.37 10.42,1.37 6.42,1.37 22.42,1.37 18.42,1.37 26.42,1.37 30.42,1.37 34.42,1.37 38.42,1.37 42.42,1.37 46.42,1.37 50.42,1.37 54.42,2.37 55.42,8.37 55.42,5.37 55.42,12.37 55.42,17.37 55.42,21.37 55.42,25.37 55.42,29.37 55.42,33.37 55.42,37.37 55.42,41.37 55.42,45.37 55.42,49.37 55.42,53.37 55.42,57.37 55.42,61.37 55.42,65.37 55.42,69.37 55.42,73.37 55.42,77.37 55.42,81.37 50.42,83.37 46.42,83.37 42.42,83.37 38.42,83.37 34.42,83.37 30.42,83.37 26.42,83.37 22.42,83.37 18.42,83.37 14.42,83.37 10.42,83.37 6.42,83.37 1.42,81.37 1.42,77.37 1.42,73.37 1.42,69.37 1.42,65.37 1.42,61.37 1.42,57.37 1.42,53.37 1.42,49.37 1.42,45.37 1.42,41.37 1.42,37.37 1.42,33.37 1.42,29.37 1.42,25.37 4.42,23.37 1.42,21.37 1.42,17.37 1.42,13.37 1.42,9.37 1.42,5.37 2.42,2.37 8.92,13.12 11.72,13.22 14.92,13.12 17.92,13.12 23.92,13.12 26.92,13.12 29.92,9.87 31.92,9.87 26.92,9.87 23.92,9.87 20.92,9.87 17.92,9.87 14.92,9.87 11.82,9.87 8.92,9.87 8.92,15.77 10.12,17.47 14.92,6.37 17.92,6.37 20.92,6.57 24.42,6.27 26.92,6.37 29.92,6.37 31.92,6.37 44.92,9.87 40.92,9.87 37.92,9.87 37.92,13.12 40.92,13.12 44.92,13.12 6.92,15.97 29.12,2.42 27.67,2.52 26.47,2.27 52.37,5.47 4.37,5.42 29.92,13.12 12.42,40.12 15.67,38.62 20.02,37.77 24.42,38.62 29.62,35.47 27.92,35.57 23.32,35.87 7.67,34.37 6.42,30.12 32.02,31.77 31.92,29.67 31.62,27.17 15.52,34.27 13.67,34.12 11.67,32.12 10.92,27.97 15.82,31.37 14.62,27.97 14.82,25.37 15.42,23.27 17.17,21.87 17.92,21.87 19.17,26.37 18.17,26.42 17.27,26.37 16.37,26.47 16.42,27.87 19.12,27.37 16.42,30.27 28.42,30.47 24.42,24.62 22.37,26.42 21.52,27.37 19.77,29.97 20.92,30.42 20.12,31.27 22.22,33.17 22.82,32.17 22.92,30.57 26.02,29.07 25.82,30.77 18.42,34.67 37.42,17.17 43.22,17.27 43.42,19.57 39.92,26.12 38.32,25.97 28.67,20.62 25.92,21.12 24.92,20.12 24.42,19.37 24.17,18.37 24.42,16.87 23.92,15.12 18.27,19.07 19.57,19.07 18.87,16.62 18.22,16.57
  pour Top (rank 2): 25.82,84.22 31.07,84.22 31.57,84.67 36.72,84.67 41.82,84.57 42.12,84.67 42.32,84.97 42.42,85.17 42.42,85.57 42.72,85.97 45.32,85.87 45.42,85.67 45.42,84.97 45.62,84.57 45.82,84.47 46.12,84.37 47.12,84.37 50.02,84.17 51.72,83.97 53.32,83.67 54.82,83.27 55.72,82.87 56.22,82.47 56.52,82.07 56.72,81.47 56.82,80.77 56.82,74.97 56.42,74.47 56.32,74.07 56.32,69.27 56.42,68.87 56.82,68.47 56.82,39.97 56.32,39.47 56.32,33.97 56.82,33.57 56.82,4.87 56.72,3.47 56.52,2.67 56.12,2.17 55.52,1.77 54.22,1.27 52.92,0.97 51.62,0.77 48.72,0.47 44.72,0.27 43.62,0.27 43.32,0.37 38.32,0.27 38.02,0.17 36.62,0.07 20.12,0.07 18.72,0.17 18.52,0.27 13.52,0.37 13.22,0.27 10.82,0.37 7.02,0.57 3.92,0.97 2.32,1.37 1.32,1.77 0.72,2.17 0.42,2.47 0.22,2.97 0.12,3.47 0.02,4.47 0.02,33.57 0.42,33.97 0.52,34.27 0.52,39.27 0.32,39.67 0.12,39.97 0.02,40.07 0.02,68.47 0.32,68.77 0.52,69.17 0.52,74.37 0.02,74.87 0.02,80.27 0.12,81.27 0.42,82.27 0.72,82.57 1.72,83.17 3.02,83.57 4.52,83.87 7.02,84.17 9.92,84.37 10.82,84.37 11.22,84.57 11.42,84.87 11.42,85.67 11.52,85.87 14.12,85.97 14.42,85.67 14.42,85.07 14.62,84.77 14.92,84.57 15.52,84.57 19.92,84.67 25.17,84.67 25.37,84.42
  pour Bottom (rank 2): 25.82,84.27 31.02,84.27 31.42,84.47 31.62,84.67 36.72,84.67 41.82,84.57 42.12,84.67 42.32,84.97 42.42,85.17 42.42,85.57 42.72,85.97 45.32,85.87 45.42,85.67 45.42,84.97 45.62,84.57 45.82,84.47 46.12,84.37 47.12,84.37 50.02,84.17 51.72,83.97 53.32,83.67 54.82,83.27 55.72,82.87 56.22,82.47 56.52,82.07 56.72,81.47 56.82,80.77 56.82,74.97 56.42,74.47 56.32,74.07 56.32,69.27 56.42,68.87 56.82,68.47 56.82,39.97 56.32,39.47 56.32,33.97 56.82,33.57 56.82,4.87 56.72,3.47 56.52,2.67 56.12,2.17 55.52,1.77 54.22,1.27 52.92,0.97 51.62,0.77 48.72,0.47 44.72,0.27 43.62,0.27 43.32,0.37 38.32,0.27 38.02,0.17 36.62,0.07 20.12,0.07 18.72,0.17 18.52,0.27 13.52,0.37 13.22,0.27 10.82,0.37 7.02,0.57 3.92,0.97 2.32,1.37 1.32,1.77 0.72,2.17 0.42,2.47 0.22,2.97 0.12,3.47 0.02,4.47 0.02,33.57 0.42,33.97 0.52,34.27 0.52,39.27 0.32,39.67 0.12,39.97 0.02,40.07 0.02,68.47 0.32,68.77 0.52,69.17 0.52,74.37 0.02,74.87 0.02,80.27 0.12,81.27 0.42,82.27 0.72,82.57 1.72,83.17 3.02,83.57 4.52,83.87 7.02,84.17 9.92,84.37 10.82,84.37 11.22,84.57 11.42,84.87 11.42,85.67 11.52,85.87 14.12,85.97 14.42,85.67 14.42,85.07 14.62,84.77 14.92,84.57 15.52,84.57 19.92,84.67 25.32,84.67 25.62,84.37
  pour Route15 (rank 2): 25.82,84.22 31.07,84.22 31.57,84.67 36.72,84.67 41.82,84.57 42.12,84.67 42.32,84.97 42.42,85.17 42.42,85.57 42.72,85.97 45.32,85.87 45.42,85.67 45.42,84.97 45.62,84.57 45.82,84.47 46.12,84.37 47.12,84.37 50.02,84.17 51.72,83.97 53.32,83.67 54.82,83.27 55.72,82.87 56.22,82.47 56.52,82.07 56.72,81.47 56.82,80.77 56.82,74.97 56.42,74.47 56.32,74.07 56.32,69.27 56.42,68.87 56.82,68.47 56.82,39.97 56.32,39.47 56.32,33.97 56.82,33.57 56.82,4.87 56.72,3.47 56.52,2.67 56.12,2.17 55.52,1.77 54.22,1.27 52.92,0.97 51.62,0.77 48.72,0.47 44.72,0.27 43.62,0.27 43.32,0.37 38.32,0.27 38.02,0.17 36.62,0.07 20.12,0.07 18.72,0.17 18.52,0.27 13.52,0.37 13.22,0.27 10.82,0.37 7.02,0.57 3.92,0.97 2.32,1.37 1.32,1.77 0.72,2.17 0.42,2.47 0.22,2.97 0.12,3.47 0.02,4.47 0.02,33.57 0.42,33.97 0.52,34.27 0.52,39.27 0.32,39.67 0.12,39.97 0.02,40.07 0.02,68.47 0.32,68.77 0.52,69.17 0.52,74.37 0.02,74.87 0.02,80.27 0.12,81.27 0.42,82.27 0.72,82.57 1.72,83.17 3.02,83.57 4.52,83.87 7.02,84.17 9.92,84.37 10.82,84.37 11.22,84.57 11.42,84.87 11.42,85.67 11.52,85.87 14.12,85.97 14.42,85.67 14.42,85.07 14.62,84.77 14.92,84.57 15.52,84.57 19.92,84.67 25.17,84.67 25.37,84.42
  pour Route2 (rank 2): 25.82,84.22 31.07,84.22 31.57,84.67 36.72,84.67 41.82,84.57 42.12,84.67 42.32,84.97 42.42,85.17 42.42,85.57 42.72,85.97 45.32,85.87 45.42,85.67 45.42,84.97 45.62,84.57 45.82,84.47 46.12,84.37 47.12,84.37 50.02,84.17 51.72,83.97 53.32,83.67 54.82,83.27 55.72,82.87 56.22,82.47 56.52,82.07 56.72,81.47 56.82,80.77 56.82,74.97 56.42,74.47 56.32,74.07 56.32,69.27 56.42,68.87 56.82,68.47 56.82,39.97 56.32,39.47 56.32,33.97 56.82,33.57 56.82,4.87 56.72,3.47 56.52,2.67 56.12,2.17 55.52,1.77 54.22,1.27 52.92,0.97 51.62,0.77 48.72,0.47 44.72,0.27 43.62,0.27 43.32,0.37 38.32,0.27 38.02,0.17 36.62,0.07 20.12,0.07 18.72,0.17 18.52,0.27 13.52,0.37 13.22,0.27 10.82,0.37 7.02,0.57 3.92,0.97 2.32,1.37 1.32,1.77 0.72,2.17 0.42,2.47 0.22,2.97 0.12,3.47 0.02,4.47 0.02,33.57 0.42,33.97 0.52,34.27 0.52,39.27 0.32,39.67 0.12,39.97 0.02,40.07 0.02,68.47 0.32,68.77 0.52,69.17 0.52,74.37 0.02,74.87 0.02,80.27 0.12,81.27 0.42,82.27 0.72,82.57 1.72,83.17 3.02,83.57 4.52,83.87 7.02,84.17 9.92,84.37 10.82,84.37 11.22,84.57 11.42,84.87 11.42,85.67 11.52,85.87 14.12,85.97 14.42,85.67 14.42,85.07 14.62,84.77 14.92,84.57 15.52,84.57 19.92,84.67 25.17,84.67 25.37,84.42
LED_A
  Top 0.1: R122.2
  Top 0.2: D123.P$1 R122.2
LED_K
  Top 0.2: D123.P$2 26.62,5.87 26.22,5.47 26.22,5.37 Q121.3
OUT_A  (via drill 0.25)
  Top 0.1: U320.D6 U320.D7
  Top 0.25: U320.C6 U320.D6
  Top 0.251: U320.D6 v20.27,34.96
  other vias: 15.02,20.27 15.02,19.77 14.52,19.77 14.52,20.27 16.02,33.77 16.52,33.77 16.52,33.27 16.02,33.27
  pour Route15: 17.87,36.12 19.87,36.12 20.47,35.52 20.47,33.97 20.12,33.62 17.82,33.62 17.02,32.82 16.42,32.82 14.37,30.77 14.37,28.57 14.12,28.32 14.12,27.52 14.37,27.27 14.37,23.57 15.62,22.32 15.62,19.87 15.27,19.52 14.22,19.52 11.47,22.27 11.47,31.32 14.07,33.92 15.22,33.92 15.37,33.77 15.72,33.77 15.87,33.92 16.67,33.92 17.22,34.47 17.22,35.47
  pour Top: 15.92,33.92 16.97,33.92 17.07,33.82 17.07,33.42 16.82,33.17 16.72,33.17 16.72,33.07 16.67,33.02 15.87,33.02 15.77,33.12 15.77,33.77
  pour Top: 14.12,21.17 16.07,21.17 16.07,19.62 14.12,19.62
OUT_B  (via drill 0.25)
  other vias: 15.02,18.37 14.52,18.37 15.02,17.87 14.52,17.87 16.42,34.97 15.82,34.97 15.82,35.47 16.42,35.47
  pour Route15: 11.92,37.32 15.52,37.32 16.67,36.17 16.67,34.77 16.52,34.62 13.57,34.62 10.37,31.42 10.37,22.22 13.77,18.82 14.92,18.82 15.17,18.57 15.17,17.17 14.52,16.52 13.02,16.52 7.47,22.07 7.47,32.82
  pour Top: 15.82,35.82 16.47,35.82 17.77,34.52 17.87,34.52 18.17,34.22 18.67,34.22 18.87,34.02 19.07,34.02 19.12,33.97 19.12,33.87 19.07,33.82 18.67,33.82 18.47,33.62 17.37,33.62 17.37,34.12 16.87,34.62 15.87,34.62 15.57,34.92 15.57,35.57
  pour Top: 14.12,18.52 16.07,18.52 16.07,16.97 14.12,16.97
PB10  (via drill 0.25)
  Top 0.1: v21.52,6.57 20.82,5.87 19.17,5.87 18.42,5.12 7.37,5.12 4.92,7.57 4.92,15.12 5.25,15.45 EE_SCL.TP 7.5,15.45 8.12,16.07 8.12,16.67 8.3,16.85 D125.P$1 U105.P$6
  Bottom 0.35: P102.54 21.92,6.97 v21.52,6.57
PB11  (via drill 0.25)
  Top 0.1: v22.72,6.57 22.27,6.12 21.42,6.12 20.92,5.62 19.42,5.62 18.67,4.87 7.22,4.87 4.67,7.42 4.67,17.12 5.54,17.99 EE_SDA.TP 7.06,16.85 D126.P$1 8.17,17.6 U105.P$5
  Bottom 0.35: P102.52 22.92,6.77 v22.72,6.57
PC0  (via drill 0.25)
  Top 0.1: v20.62,27.67 20.92,27.97 20.92,29.27 20.79,29.4 D322.P$1 20.42,29.6 20.42,30.47 21.46,31.51 U320.G1 | U320.G1 | U320.G1
  Route15 0.1: v20.62,27.67 20.82,27.87 21.72,27.87 22.82,28.97 24.72,28.97 25.32,28.37 26.62,28.37 27.22,28.97 29.52,28.97 30.91,27.59 37.31,27.59 48.72,16.18 48.72,10.65 47,8.93 47,6.45 v46.92,6.37
  Bottom 0.35: P102.4 v46.92,6.37
PC1  (via drill 0.25)
  Top 0.1: v19.92,28.17 19.62,28.47 19.62,29.27 19.75,29.4 D321.P$1 20.17,29.65 20.17,30.62 21.06,31.51 U320.F1 | U320.F1 | U320.F1
  Route15 0.1: v47.92,6.37 47.84,6.46 47.84,9.35 48.97,10.48 48.97,16.33 37.42,27.87 31.02,27.87 29.62,29.27 27.12,29.27 26.52,28.67 25.42,28.67 24.82,29.27 22.72,29.27 21.62,28.17 v19.92,28.17
  Bottom 0.35: P102.2 v47.92,6.37
PC7  (via drill 0.25)
  Top 0.1: 17.92,32.77 18.42,32.77 18.78,33.13 U320.A4 | 17.92,32.77 17.82,32.87 D328.P$1 17.45,32.7 17.32,32.57 16.82,32.57 16.42,32.17 v16.42,31.87 | 17.92,32.77 17.92,32.62 R330.2
  Route15 0.1: v36.92,13.12 36.92,14.62 32.67,18.87 27.17,18.87 20.17,25.87 20.17,26.92 19.22,27.87 19.22,30.57 18.42,31.37 16.92,31.37 v16.42,31.87
  Bottom 0.35: P102.23 v36.92,13.12
PC14  (via drill 0.25)
  Top 0.1: v18.62,27.67 19.22,28.27 19.22,29.27 19.12,29.37 18.95,29.37 D323.P$1 18.92,29.67 19.56,30.31 19.56,31.83 19.52,31.87 | 19.52,31.87 U320.B1 | U320.B1 | U320.B1 19.52,31.92 19.52,31.87
  Route15 0.1: v18.62,27.67 18.62,25.75 27,17.37 32.92,17.37 35.92,14.37 v35.92,13.12
  Bottom 0.35: v35.92,13.12 P102.25
PC15  (via drill 0.25)
  Top 0.1: v17.72,28.07 17.92,28.27 17.92,29.27 18.05,29.4 D324.P$1 18.39,29.57 18.42,29.57 19.32,30.47 19.32,31.47 19.06,31.73 U320.A1 | U320.A1 | U320.A1
  Route15 0.1: v34.92,13.12 34.92,14.1 32.55,16.47 26.63,16.47 17.72,25.38 v17.72,28.07
  Bottom 0.35: v34.92,13.12 P102.27
PD7  (via drill 0.25)
  Top 0.1: v16.32,29.67 16.42,29.77 17.22,29.77 17.45,30 D326.P$1 18.22,30.07 18.72,30.57 18.72,31.27 18.42,31.57 18.42,32.17 18.98,32.73 U320.A3
  Route15 0.1: v32.92,13.12 32.92,13.56 31.81,14.67 25.88,14.67 15.92,24.63 15.92,29.27 v16.32,29.67
  Bottom 0.35: v32.92,13.12 P102.31
PE7  (via drill 0.25)
  Top 0.1: v16.82,28.47 17.45,29.1 D325.P$1 17.85,29.77 18.27,29.77 19.02,30.52 19.02,31.37 18.72,31.67 18.72,32.07 18.98,32.33 U320.A2
  Route15 0.1: v16.82,28.47 16.82,25.01 26.26,15.57 32.18,15.57 33.92,13.83 v33.92,13.12
  Bottom 0.35: v33.92,13.12 P102.29
PG9  (via drill 0.25)
  Top 0.1: v10.92,6.37 9.92,5.37 7.42,5.37 5.17,7.62 5.17,12.37 5.71,12.91 EE_WP.TP 6.71,12.91 9.65,15.85 D124.P$1 R108.2 9.55,16.44 9.32,16.67 9.32,17.37 9.17,17.52 U105.P$7
  Bottom 0.35: P102.76 v10.92,6.37
PG10  (via drill 0.25)
  Top 0.1: v26.32,29.67 DEMO_EN.TP | DEMO_EN.TP 27,28.95 | DEMO_EN.TP 27.95,29.9 R307.1 D306.P$1 28.27,31.09 U300.B2
  Route15 0.1: v9.92,6.37 11.12,5.17 48.12,5.17 48.92,5.97 48.92,9.27 49.42,9.77 49.42,17.48 38.12,28.77 31.42,28.77 30.12,30.07 26.72,30.07 v26.32,29.67
  Bottom 0.35: P102.78 v9.92,6.37
PH0  (via drill 0.25)
  Top 0.05: 19.26,32.93 18.88,32.93
  Top 0.08: 18.88,32.93 18.72,32.77 | U320.B4 19.26,32.93
  Top 0.1: v18.02,30.77 D327.P$1 R329.2 17.52,31.47 18.02,31.97 18.02,32.08 18.72,32.77 | U320.B4
  Route15 0.1: v18.02,30.77 16.32,30.77 15.22,29.67 15.22,24.07 16.43,22.86 16.43,15.88 14.52,13.97 14.52,6.97 v13.92,6.37
  Bottom 0.35: v13.92,6.37 P102.70
POWERGOOD
  Top 0.1: Q121.1 24.31,5.67 U120.2
SPKOUT_A
  Top 0.1: VR354.P$1 18.14,20.34 18.17,20.37 18.15,20.37 VR354.P$1
  Top 0.25: C355.2 C353.1 | C353.1 19.39,20.34 21.67,22.62 21.67,24.2 M358.1 | C353.1 18.2,20.34 18.17,20.37 17.87,20.07 E351.2
  pour Top: 20.17,25.32 22.57,25.32 22.57,20.17 21.92,19.52 16.77,19.52 16.67,19.62 16.67,20.42 19.22,20.42 20.17,21.37
SPKOUT_B
  Top 0.25: C356.1 C355.1 | C356.1 VR357.P$1 17.24,17.8 16.97,18.07 E352.2 | C356.1 19.83,17.8 21.62,16.01 M359.1
  pour Top: 16.67,17.72 16.67,18.52 16.77,18.62 21.87,18.62 22.57,17.92 22.57,12.82 20.17,12.82 20.17,16.82 19.27,17.72
VBST
  pour Top: 17.57,36.52 21.87,36.52 22.67,37.32 23.62,37.32 23.87,37.07 23.87,36.67 23.62,36.42 23.17,36.42 21.57,34.82 21.57,34.32 21.52,34.27 20.62,34.27 20.57,34.32 20.57,34.52 20.82,34.77 20.82,35.27 20.57,35.52 20.07,35.52 19.77,35.22 19.77,34.77 19.97,34.57 19.97,34.32 19.92,34.27 19.12,34.27 18.87,34.52 18.87,34.87 18.62,35.12 18.07,35.12 17.57,35.62
VINB
  pour Top: 23.47,35.37 23.47,33.92 23.17,33.62 21.82,33.62 21.62,33.82 20.67,33.82 20.62,33.87 20.62,33.97 20.67,34.02 20.77,34.02 20.82,34.07 21.62,34.07 21.77,34.22 21.77,34.37 22.77,35.37
(copper drawn outside any net)
  shapes: Bottom circle x24, Top circle x12